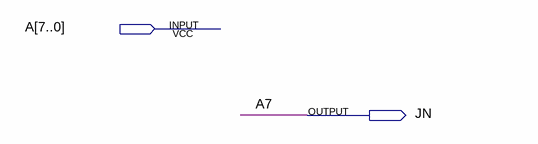
[diagram p0: schematic sheet]
// Quartus schematic JN.bdf as structural Verilog: 0 symbols, 2 pins
module JN (
  input  [7:0] A,
  output JN
);


  assign JN = A[7];
endmodule
